# EAGLE design under_construction_v0 (EAGLE 6.6.0)
DATABASE: /Users/mhenstell/Documents/eagle/partsdb.txt
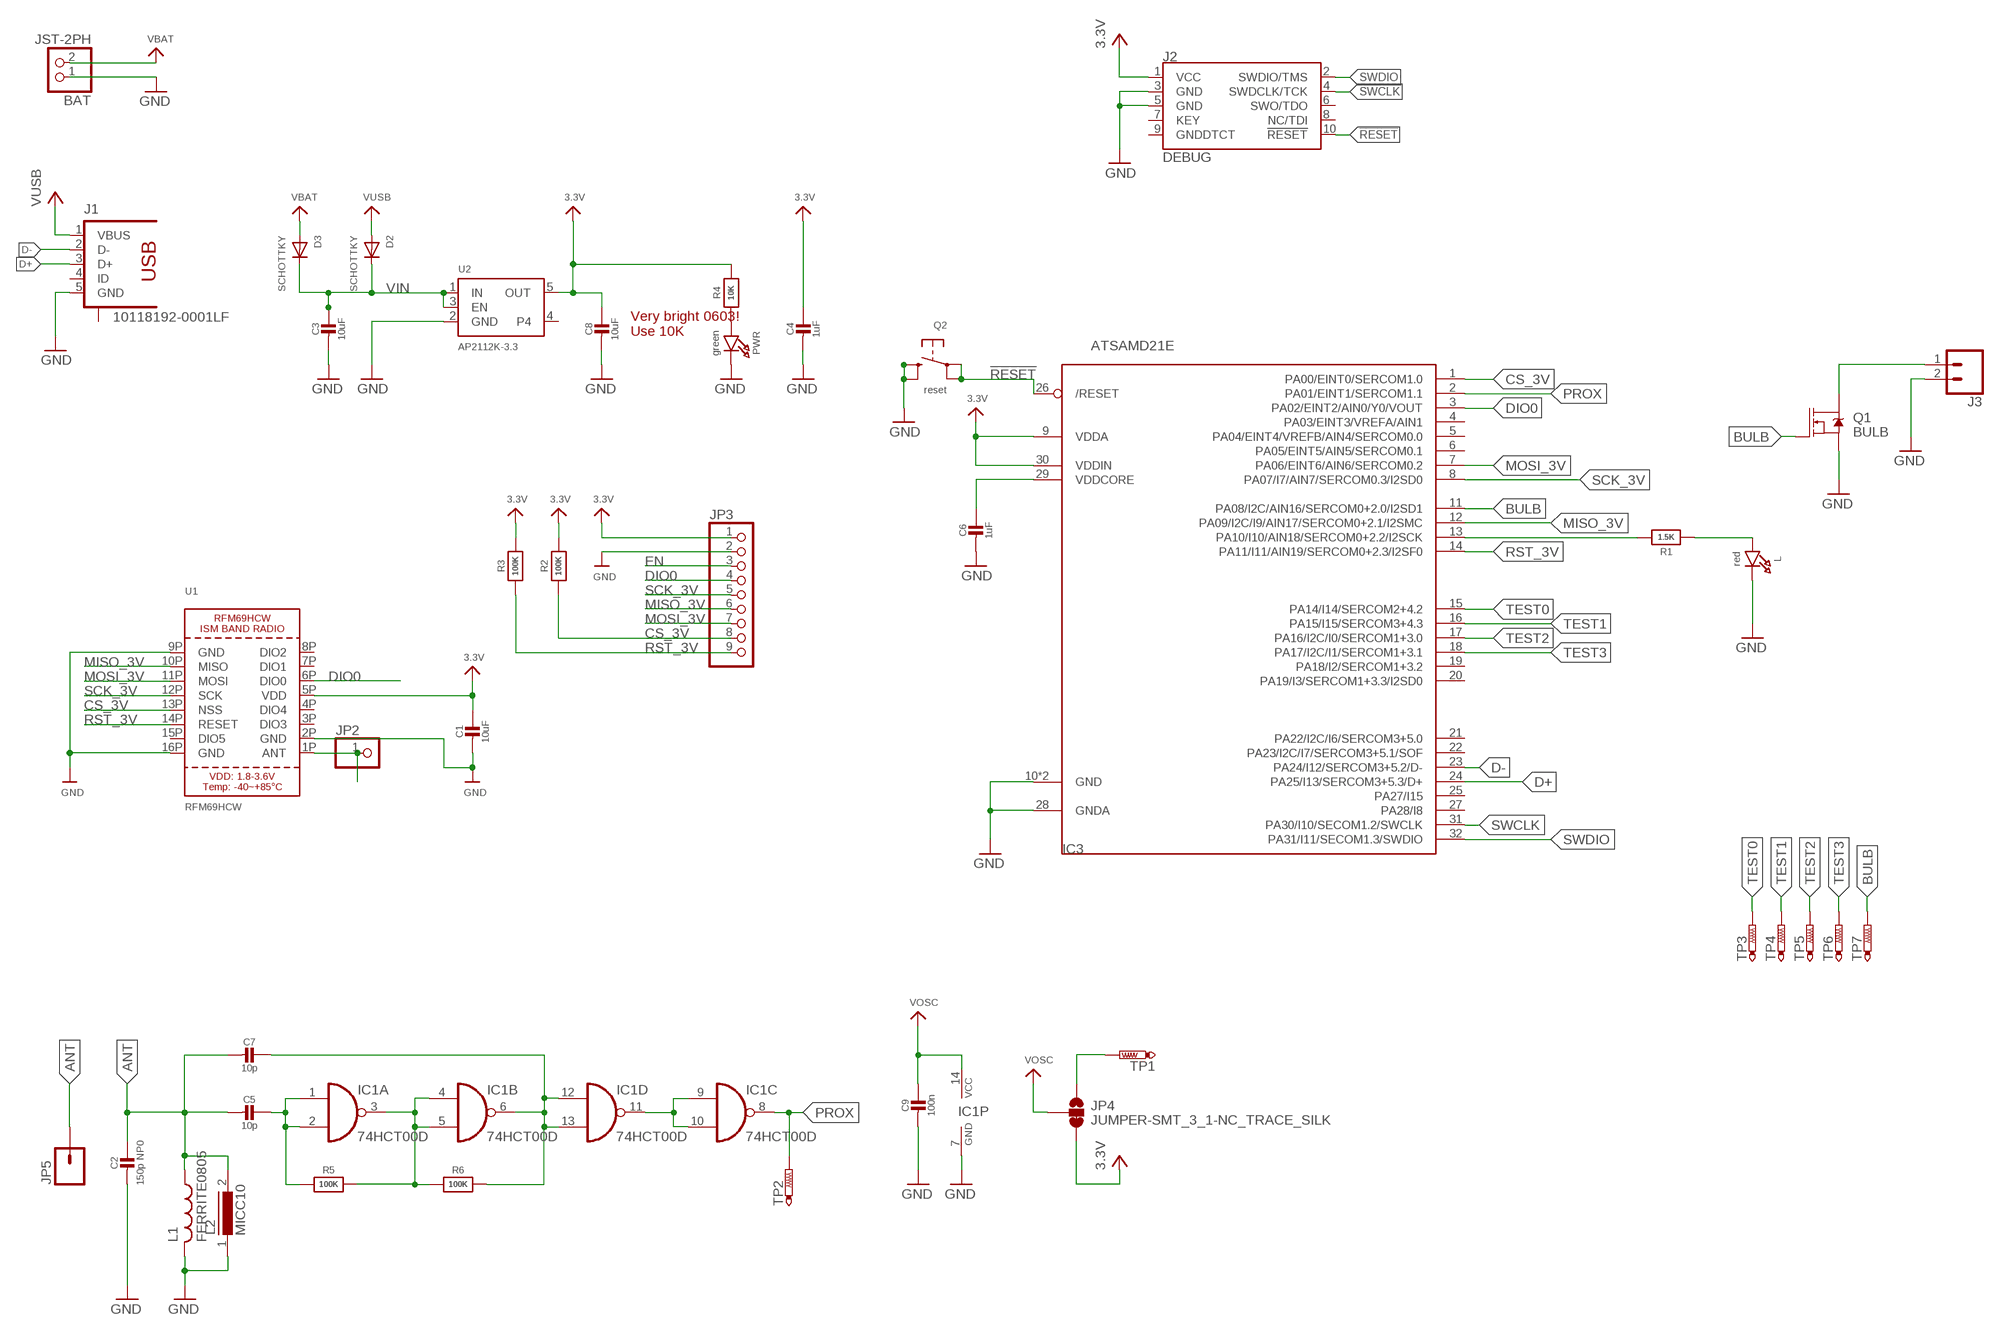
[diagram p0: schematic, sheet 1]

## Parts
BAT  JST-2PH  CON_JST_PH_2PIN  [JSTPH2]
C1  10uF  CAP_CERAMIC0805-NOOUTLINE  [0805-NO]
C2  150p NP0  CAP_CERAMIC0805-NOOUTLINE  [0805-NO]
C3  10uF  CAP_CERAMIC0805-NOOUTLINE  [0805-NO]
C4  1uF  CAP_CERAMIC0603_NO  [0603-NO]
C5  10p  CAP_CERAMIC0805-NOOUTLINE  [0805-NO]
C6  1uF  CAP_CERAMIC0603_NO  [0603-NO]
C7  10p  CAP_CERAMIC0805-NOOUTLINE  [0805-NO]
C8  10uF  CAP_CERAMIC0805-NOOUTLINE  [0805-NO]
C9  100n  CAP_CERAMIC0805-NOOUTLINE  [0805-NO]
D2  SCHOTTKY  DIODE_SOD-123FL  [SOD-123FL]
D3  SCHOTTKY  DIODE_SOD-123FL  [SOD-123FL]
IC1  74HCT00D  [SO14]
IC3  ATSAMD21E  [QFN32_5MM]
J1  10118192-0001LF  [10118192-0001LF]
J2  DEBUG  CORTEX_DEBUG_SMD  [SAMTECH_FTSH-105-01]
J3  CONN_02  [1X02]
JP2  HEADER-1X1ROUND  [1X01_ROUND]
JP3  HEADER-1X970MIL  [1X09_ROUND_70]
JP4  JUMPER-SMT_3_1-NC_TRACE_SILK  [SMT-JUMPER_3_1-NC_TRACE_SILK]
JP5  M01PTH  [1X01]
L  red  LED0603_NOOUTLINE  [CHIPLED_0603_NOOUTLINE]
L1  FERRITE0805  [0805]
L2  MICC10  [MICC10]
PWR  green  LED0603_NOOUTLINE  [CHIPLED_0603_NOOUTLINE]
Q1  BULB  MOSFET-NCH-2N7002PW  [SOT323]
Q2  reset  SWITCH_TACT_SMT4.6X2.8  [BTN_KMR2_4.6X2.8]
R1  1.5K  RESISTOR_0603_NOOUT  [0603-NO]
R2  100K  RESISTOR0805_NOOUTLINE  [0805-NO]
R3  100K  RESISTOR0805_NOOUTLINE  [0805-NO]
R4  10K  RESISTOR_0603_NOOUT  [0603-NO]
R5  100K  RESISTOR0805_NOOUTLINE  [0805-NO]
R6  100K  RESISTOR0805_NOOUTLINE  [0805-NO]
TP1  VOSC  PTR1TP15R  [TP15R]
TP2  PROX  PTR1TP15R  [TP15R]
TP3  PTR1TP10R  [TP10R]
TP4  PTR1TP10R  [TP10R]
TP5  PTR1TP10R  [TP10R]
TP6  PTR1TP10R  [TP10R]
TP7  PTR1TP10R  [TP10R]
U1  RFM69HCW  RFM69HCW_SMT  [RFMHCW_SMT]
U2  AP2112K-3.3  VREG_SOT23-5  [SOT23-5]

## Nets
3.3V: C1.1 C4.1 C8.1 IC3.9(VDDA) IC3.30(VDDIN) J2.1(VCC) JP3.1 JP4.3 R2.2 R3.2 R4.2 U1.5P(VDD) U2.5(OUT)
!RESET: IC3.26(/RESET) J2.10(!RESET) Q2.A'(P1) Q2.A(P)
ANT: C2.1 C5.2 C7.2 JP5.1 L1.1 L2.2
BULB: IC3.11(PA08/I2C/AIN16/SERCOM0+2.0/I2SD1) Q1.1(G) TP7.TP
CS_3V: IC3.1(PA00/EINT0/SERCOM1.0) JP3.8 R2.1 U1.13P(NSS)
D+: IC3.24(PA25/I13/SERCOM3+5.3/D+) J1.3(D+)
D-: IC3.23(PA24/I12/SERCOM3+5.2/D-) J1.2(D-)
DIO0: IC3.3(PA02/EINT2/AIN0/Y0/VOUT) JP3.4 U1.6P(DIO0)
EN: JP3.3
GND: BAT.1 C1.2 C2.2 C3.2 C4.2 C6.2 C8.2 C9.2 IC1.7(P:GND) IC3.10(GND) IC3.28(GNDA) IC3.33(GND) J1.5(GND) J2.3(GND) J2.5(GND) J3.2 JP3.2 L1.2 L2.1 L.C PWR.C Q1.2(S) Q2.B'(S1) Q2.B(S) U1.2P(GND) U1.9P(GND) U1.16P(GND) U2.2(GND)
MISO_3V: IC3.12(PA09/I2C/I9/AIN17/SERCOM0+2.1/I2SMC) JP3.6 U1.10P(MISO)
MOSI_3V: IC3.7(PA06/EINT6/AIN6/SERCOM0.2) JP3.7 U1.11P(MOSI)
N$1: JP2.1 U1.1P(ANT)
N$2: C5.1 IC1.1(A:I0) IC1.2(A:I1) R5.1
N$3: IC1.3(A:O) IC1.4(B:I0) IC1.5(B:I1) R5.2 R6.1
N$4: C7.1 IC1.6(B:O) IC1.12(D:I0) IC1.13(D:I1) R6.2
N$5: L.A R1.1
N$6: PWR.A R4.1
N$7: IC1.9(C:I0) IC1.10(C:I1) IC1.11(D:O)
N$8: IC3.13(PA10/I10/AIN18/SERCOM0+2.2/I2SCK) R1.2
N$9: J3.1 Q1.3(D)
N$10: JP4.1 TP1.TP
PROX: IC1.8(C:O) IC3.2(PA01/EINT1/SERCOM1.1) TP2.TP
RST_3V: IC3.14(PA11/I11/AIN19/SERCOM0+2.3/I2SF0) JP3.9 R3.1 U1.14P(RESET)
SCK_3V: IC3.8(PA07/I7/AIN7/SERCOM0.3/I2SD0) JP3.5 U1.12P(SCK)
SWCLK: IC3.31(PA30/I10/SECOM1.2/SWCLK) J2.4(SWDCLK/TCK)
SWDIO: IC3.32(PA31/I11/SECOM1.3/SWDIO) J2.2(SWDIO/TMS)
TEST0: IC3.15(PA14/I14/SERCOM2+4.2) TP3.TP
TEST1: IC3.16(PA15/I15/SERCOM3+4.3) TP4.TP
TEST2: IC3.17(PA16/I2C/I0/SERCOM1+3.0) TP5.TP
TEST3: IC3.18(PA17/I2C/I1/SERCOM1+3.1) TP6.TP
VBAT: BAT.2 D3.A
VDDCORE1: C6.1 IC3.29(VDDCORE)
VIN: C3.1 D2.C D3.C U2.1(IN) U2.3(EN)
VOSC: C9.1 IC1.14(P:VCC) JP4.2
VUSB: D2.A J1.1(VBUS)
Unconnected: IC3.4(PA03/EINT3/VREFA/AIN1) IC3.5(PA04/EINT4/VREFB/AIN4/SERCOM0.0) IC3.6(PA05/EINT5/AIN5/SERCOM0.1) IC3.19(PA18/I2/SERCOM1+3.2) IC3.20(PA19/I3/SERCOM1+3.3/I2SD0) IC3.21(PA22/I2C/I6/SERCOM3+5.0) IC3.22(PA23/I2C/I7/SERCOM3+5.1/SOF) IC3.25(PA27/I15) IC3.27(PA28/I8) J1.4(ID) J1.M1(S) J1.M2(S) J1.S1(S) J1.S2(S) J1.S3(S) J1.S4(S) J2.6(SWO/TDO) J2.7(KEY) J2.8(NC/TDI) J2.9(GNDDTCT) U1.3P(DIO3) U1.4P(DIO4) U1.7P(DIO1) U1.8P(DIO2) U1.15P(DIO5) U2.4

## Notes on the sheet
- Very bright 0603!
  Use 10K

## Library data of the parts
BAT = microbuilder:CON_JST_PH_2PIN: JST 2-Pin Right-Angle Connector PH-Series - 4UConnector: 17311 SH-Series - 4UConnector: 07278; PARTNO: S2B-PH-SM4-TB(LF)(SN)
C1 C3 C8 = microbuilder:CAP_CERAMIC: Ceramic Capacitors For new designs, use the packages preceded by an '_' character since they are more reliable: The following footprints should be used on most boards: _0402 - Standard footprint for regular board layouts _0603 - Standard footprint for regular board layouts _0805 - Standard footprint for regular board layouts _1206 - Standard footprint for regular board layouts For extremely tight-pitch boards where space is at a premium, the following 'micro-pitch' footprints can be used (smaller pads, no silkscreen outline, etc.): _0402MP - Micro-pitch footprint for very dense/compact boards _0603MP - Micro-pitch footprint for very dense/compact boards _0805MP - Micro-pitch footprint for very dense/compact boards _1206MP - Micro-pitch footprint for very dense/compact boards; PARTNO: GRM21BR71A106MA73L
C2 = microbuilder:CAP_CERAMIC: Ceramic Capacitors For new designs, use the packages preceded by an '_' character since they are more reliable: The following footprints should be used on most boards: _0402 - Standard footprint for regular board layouts _0603 - Standard footprint for regular board layouts _0805 - Standard footprint for regular board layouts _1206 - Standard footprint for regular board layouts For extremely tight-pitch boards where space is at a premium, the following 'micro-pitch' footprints can be used (smaller pads, no silkscreen outline, etc.): _0402MP - Micro-pitch footprint for very dense/compact boards _0603MP - Micro-pitch footprint for very dense/compact boards _0805MP - Micro-pitch footprint for very dense/compact boards _1206MP - Micro-pitch footprint for very dense/compact boards; PARTNO: C0805C151J5GACTU
C4 C6 = microbuilder:CAP_CERAMIC: Ceramic Capacitors For new designs, use the packages preceded by an '_' character since they are more reliable: The following footprints should be used on most boards: _0402 - Standard footprint for regular board layouts _0603 - Standard footprint for regular board layouts _0805 - Standard footprint for regular board layouts _1206 - Standard footprint for regular board layouts For extremely tight-pitch boards where space is at a premium, the following 'micro-pitch' footprints can be used (smaller pads, no silkscreen outline, etc.): _0402MP - Micro-pitch footprint for very dense/compact boards _0603MP - Micro-pitch footprint for very dense/compact boards _0805MP - Micro-pitch footprint for very dense/compact boards _1206MP - Micro-pitch footprint for very dense/compact boards; PARTNO: CL21B105KOFNNNE
C5 C7 = microbuilder:CAP_CERAMIC: Ceramic Capacitors For new designs, use the packages preceded by an '_' character since they are more reliable: The following footprints should be used on most boards: _0402 - Standard footprint for regular board layouts _0603 - Standard footprint for regular board layouts _0805 - Standard footprint for regular board layouts _1206 - Standard footprint for regular board layouts For extremely tight-pitch boards where space is at a premium, the following 'micro-pitch' footprints can be used (smaller pads, no silkscreen outline, etc.): _0402MP - Micro-pitch footprint for very dense/compact boards _0603MP - Micro-pitch footprint for very dense/compact boards _0805MP - Micro-pitch footprint for very dense/compact boards _1206MP - Micro-pitch footprint for very dense/compact boards; PARTNO: CL21C100JCANNNC
C9 = microbuilder:CAP_CERAMIC: Ceramic Capacitors For new designs, use the packages preceded by an '_' character since they are more reliable: The following footprints should be used on most boards: _0402 - Standard footprint for regular board layouts _0603 - Standard footprint for regular board layouts _0805 - Standard footprint for regular board layouts _1206 - Standard footprint for regular board layouts For extremely tight-pitch boards where space is at a premium, the following 'micro-pitch' footprints can be used (smaller pads, no silkscreen outline, etc.): _0402MP - Micro-pitch footprint for very dense/compact boards _0603MP - Micro-pitch footprint for very dense/compact boards _0805MP - Micro-pitch footprint for very dense/compact boards _1206MP - Micro-pitch footprint for very dense/compact boards; PARTNO: C0805C104K5RACTU
D2 D3 = adafruit:DIODE: Diode SMADIODE - SMA Surface Mount Package 20V 1A Schottky Diode Digikey: 641-1014-6-ND DO-1N4148 - Through Hole Small Current Diode SOD-123 20V 1 A (.5mV Vf) Schottky Diode - Digikey: MBRX120TPMSCT-ND SOD-323 10V 570mA (.38mV Vf, 3ns) Schottky Diode - Digikey: ZLLS410CT-ND SOD-523 30V 30mA Schottky Diode (RB751S-40TE61) - Digikey: RB751S-40TE61CT-ND SOT23-R/W - SOT23 Package (R = Solder Paste/Reflow Ovens, W = Hand-Soldering) BAT54Film 40V 300mA - Digikey: 497-7162-1-ND; PARTNO: B130LAW-7-F
IC1 = 74xx-eu:74*00: Quad 2-input NAND gate; PARTNO: SN74HC00NSR
IC3 = microbuilder:ATSAMD21E; PARTNO: ATSAMD21E18A-MU
J1 = 10118192-0001LF:10118192-0001LF: USB - microUSB Type B, FCI; AVAILABILITY: Good; DESCRIPTION: Conn Micro USB Type B RCP 5 POS 0.65mm Solder RA SMD 5 Terminal 1 Port T/R; MF: FCI; MP: 10118192-0001LF; PACKAGE: None; PARTNO: 10118192-0001LF; PRICE: 0.23 USD
J2 = SparkFun-Connectors:CORTEX_DEBUG: Cortex Debug Connector - 10 pin Supports JTAG debug, Serial Wire debug, and Serial Wire Viewer. PTH and SMD connector options available. General Connector Information <http://infocenter.arm.com/help/topic/com.arm.doc.faqs/attached/13634/cortex_debug_connectors.pdf> Products: PTH Connector <http://www.digikey.com/product-detail/en/cnc-tech/3220-10-0100-00/1175-1627-ND/3883661> -via Digi-Key SparkFun PSoc <https://www.sparkfun.com/products/13229> SparkFun T <https://www.sparkfun.com/products/13810>; PARTNO: 3220-10-0300-00
J3 = SparkFun-Connectors:CONN_02: Multi connection point. Often used as Generic Header-pin footprint for 0.1 inch spaced/style header connections On any of the 0.1 inch spaced packages, you can populate with these: Break Away Headers - Straight <https://www.sparkfun.com/products/116> (PRT-00116) Break Away Male Headers - Right Angle <https://www.sparkfun.com/products/553> (PRT-00553) Female Headers <https://www.sparkfun.com/products/115> (PRT-00115) Break Away Headers - Machine Pin <https://www.sparkfun.com/products/117> (PRT-00117) Break Away Female Headers - Swiss Machine Pin <https://www.sparkfun.com/products/743> (PRT-00743) For SCREWTERMINALS and SPRING TERMINALS visit here: Screw Terimnals on SparkFun.com <https://www.sparkfun.com/search/results?term=Screw+Terminals> (5mm/3.5mm/2.54mm spacing) This device is also useful as a general connection point to wire up your design to another part of your project. Our various solder wires solder well into these plated through hole pads. Hook-Up Wire - Assortment (Stranded, 22 AWG) <https://www.sparkfun.com/products/11375> (PRT-11375) Hook-Up Wire - Assortment (Solid Core, 22 AWG) <https://www.sparkfun.com/products/11367> (PRT-11367) View the entire wire category on our website here <https://www.sparkfun.com/categories/141> Special notes: Molex polarized connector foot print use with: PRT-08233 with associated crimp pins and housings. 2.54_SCREWTERM for use with PRT-10571. 3.5mm Screw Terminal footprints for PRT-08084 5mm Screw Terminal footprints for use with PRT-08432
JP2 = microbuilder:HEADER-1X1: PIN HEADER
JP3 = microbuilder:HEADER-1X9: PIN HEADER
JP4 = SparkFun-Jumpers:JUMPER-SMT_3_1-NC_TRACE: Normally closed trace jumper (1 of 2 connections) This jumper has a trace between two pads so it's normally closed (NC). The other connection is normally open (NO). Use a razor knife to open the connection. For best results follow the IPC guidelines for cutting traces: Cutout at least 0.063 mm (0.005 in). Remove all loose material to clean up the cut area. Seal the cut with an approved epoxy. Reapply solder to reclose the connection, or to close the NO connection.
JP5 = RFM69HCW_BOB:M01: Header 1 Standard 1-pin 0.1" header. Use with straight break away headers (SKU : PRT-00116), right angle break away headers (PRT-00553), swiss pins (PRT-00743), machine pins (PRT-00117), and female headers (PRT-00115).
L PWR = microbuilder:LED: LED 0603 - 0603 Surface Mount Package 2mA: Green LED - Low Power (3.9mcd, 2ma, 1.7Vf) - Digikey: 475-2709-2-ND Orange LED - Low Power (9.8mcd, 2ma, 1.8Vf) - Digikey: 475-1194-2-ND Red LED - Low Power (5mcd, 2ma, 1.8Vf) - Digikey: 475-1195-2-ND Yellow LED - Low Power (7mcd, 2ma, 1.8Vf) - Digikey: 475-1196-2-ND 5mA: Blue LED - Low Power (17mcd, 5ma, 2.9Vf) - Digikey: LNJ937W8CRACT-ND 0805 - 0805 Surface Mount Package 2mA: Red LED (8.8mcd, 2mA, 1.8Vf, Clear) - Low Power [Digikey: 475-2510-1-ND] Green LED (5mcd, 2mA, 1.8Vf, Clear) - Low Power [Digikey: 475-2730-1-ND] Yellow LED (11.3mcd, 2mA, 1.8Vf, Clear) - Low Power [Digikey: 475-2555-1-ND] 20mA: Red LED (104mcd, 20mA, Diffused) - LS R976 [Digikey: 475-1278-6-ND] Red LED (12mcd, 20mA, 2.0Vf, Clear) - APT2012EC [Digikey: 754-1128-1-ND] Green LED (15mcd, 20mA, 2.2Vf, Clear) - APT2012GC [Digikey: 754-1131-1-ND] Orange LED (160mcd, 20mA, 2.1Vf, Clear) - APT2012SECK [Digikey: 754-1130-1-ND] 1206 - 1206 Surface Mount Package Green LED (26mcd, 20mA, Diffused) - LG N971 [Digikey: 475-1407-6-ND] Red LED (15mcd, 20mA, Diffused) - LH N974 [Digikey: 475-1416-6-ND] Cree - Cree High-Power Surface Mount LEDs XPEBWT-L1-0000-00D50 - White 111lm 350mA 2.9Vf 6200K 110° XTEAWT-00-0000-00000LEE3 - White 114lm 350mA 2.85Vf 5000K 115° Everlight - Everlight 45-21 Series Surface Mount LEDs 45-21/QK2C-B2832AC2CB2/2T - Warm White 2000mcd 20mA 3.25Vf 3050K 120° 45-21/LK2C-B38452C4CB2/2T - Nuetral White 2000mcd 20mA 3.25Vf 4150K 120° 45-21/LK2C-B50634C6CB2/2T - Cold White 2200mcd 20mA 3.25Vf 5650K 120° PLCC2 Reverse Mount LS T77K-J1L2-1-0-2-R18-Z - Red 11.25mcd 2mA 1.8Vf 630nm 120° LO T77K-L1M2-24-Z - Orange 19.6mcd 2mA 1.8Vf 606nm 120° LY T77K-K2M1-26-Z - Yellow 15.7mcd 2mA 1.8Vf 587nm 120°
L1 = Livestream:FERRITE; PARTNO: MLZ2012N100LT000
L2 = inductors:MICC10: INDUCTOR; PARTNO: B78108T1103K000
Q1 = SparkFun-DiscreteSemi:MOSFET-NCH: N-channel MOSFETs Voltage controlled devices that allow control of high current outputs. SparkFun Products: SparkFun OpenScale <https://www.sparkfun.com/products/13261> SparkFun Digital Sandbox <https://www.sparkfun.com/products/12651> SparkFun Monster Moto Shield <https://www.sparkfun.com/products/10182> SparkFun MOSFET Power Controller <https://www.sparkfun.com/products/11214>; PARTNO: DMG1012UW-7; PROD_ID: TRANS-11151; VALUE: 310mA/60V/1.6Ω
Q2 = microbuilder:SWITCH_TACT_SMT: SMT Tact Switches 6x6mm - Digikey: P12940SCT-ND KMR2 (4.6x2.8mm) - Digikey: 401-1426-1-ND EVQ-PQHB55 - Light Touch, 160GF (4.5x4.5mm) - Digikey: P8090SCT-ND KMT0 - KMT021 NGJ LHS (etc.) IP68/Waterproof - Digikey: CKN10289CT-ND; PARTNO: KMR442G ULC LFS
R1 = microbuilder:RESISTOR: Resistors For new designs, use the packages preceded by an '_' character since they are more reliable: The following footprints should be used on most boards: _0402 - Standard footprint for regular board layouts _0603 - Standard footprint for regular board layouts _0805 - Standard footprint for regular board layouts _1206 - Standard footprint for regular board layouts For extremely tight-pitch boards where space is at a premium, the following 'micro-pitch' footprints can be used (smaller pads, no silkscreen outline, etc.): _0402MP - Micro-pitch footprint for very dense/compact boards _0603MP - Micro-pitch footprint for very dense/compact boards _0805MP - Micro-pitch footprint for very dense/compact boards _1206MP - Micro-pitch footprint for very dense/compact boards; PARTNO: RNCP0603FTD1K50
R2 R3 R5 R6 = microbuilder:RESISTOR: Resistors For new designs, use the packages preceded by an '_' character since they are more reliable: The following footprints should be used on most boards: _0402 - Standard footprint for regular board layouts _0603 - Standard footprint for regular board layouts _0805 - Standard footprint for regular board layouts _1206 - Standard footprint for regular board layouts For extremely tight-pitch boards where space is at a premium, the following 'micro-pitch' footprints can be used (smaller pads, no silkscreen outline, etc.): _0402MP - Micro-pitch footprint for very dense/compact boards _0603MP - Micro-pitch footprint for very dense/compact boards _0805MP - Micro-pitch footprint for very dense/compact boards _1206MP - Micro-pitch footprint for very dense/compact boards; PARTNO: RC2012J104CS
R4 = microbuilder:RESISTOR: Resistors For new designs, use the packages preceded by an '_' character since they are more reliable: The following footprints should be used on most boards: _0402 - Standard footprint for regular board layouts _0603 - Standard footprint for regular board layouts _0805 - Standard footprint for regular board layouts _1206 - Standard footprint for regular board layouts For extremely tight-pitch boards where space is at a premium, the following 'micro-pitch' footprints can be used (smaller pads, no silkscreen outline, etc.): _0402MP - Micro-pitch footprint for very dense/compact boards _0603MP - Micro-pitch footprint for very dense/compact boards _0805MP - Micro-pitch footprint for very dense/compact boards _1206MP - Micro-pitch footprint for very dense/compact boards
TP1-TP7 = tenna_avr_AD7021_v0_9_shrink:PTR1: TEST PIN .063mm, 25mil circular test point
U1 = microbuilder:RFM69HCW: RFM69HCW - ISM Band RF Transceiver
U2 = microbuilder:VREG_SOT23-5: SOT23-5 Fixed Voltage Regulators Part Current Out V Out V In V Dropout θJA (°C/W) TJ (°C) Digikey Part No. ADP121 150mA 3.3V 3.4-5.5V 0.09V @ 150mA -- -- ADP121-AUJZ33R7CT-ND ADP121 150mA 3.0V 3.1-5.5V 0.09V @ 150mA -- -- ADP121-AUJZ30R7CT-ND ADP122 300mA 3.3V 3.4-5.5V 0.085V @ 300mA -- -- ADP122AUJZ-3.3-R7CT-ND ADP1712 300mA 3.3V 3.5-5.5V 0.17V @ 300mA -- -- ADP1712AUJZ-3.3-R7TR-ND AP7311 (Low Cost) 150mA 3.3V 3.5-6V 0.15V @ 150mA -- -- AP7311-33WG-7DICT-ND LD39015M18R 150mA 1.8V 1.9V-5.5V 0.08V @ 100mA -- -- 497-6977-1-ND LP2985A-33DBVR 150mA 3.3V 3.3-16V 0.28V @ 150mA 206 150 296-18479-1-ND MCP1824T-3302E/OT 300mA 3.3V 3.5V-6V 0.2V @ 300mA -- -- MCP1824T-3302E/OTCT-ND MIC5205-2.5YM5 TR 150mA 2.5V 2.7-16V 0.165V @ 150mA -- -- 576-1257-2-ND MIC5205-3.0YM5 TR 150mA 3.0V 3.2V-16V 0.165V @ 150mA -- -- 576-1258-2-ND MIC5205-3.3YM5 TR 150mA 3.3V 3.5V-16V 0.165V @ 150mA -- -- 576-1259-2-ND TPS780330220 150mA 3.3V+2.2V 3.6-5.5V 250mV Max -- -- 296-23332-1-ND TDA3663/N1,135 100mA 3.3V 3.5-45V 0.18V @ 50mA -- -- 568-5343-1-ND Max operating temp can be calculated using θJA, TJ (max junction temperature), and power in watts. Set the "Maximum Ambient Temperature" until it reaches TJ ("Max Junction Temperature"), which is the absolute limit for safe use of the regulator: Heat Sink Temperature Calculator <http://www.daycounter.com/Calculators/Heat-Sink-Temperature-Calculator.phtml> For example, With 12V source into a 3.3V LP2985 and a 30mA load, we are dissipating (12V-3.3V) * 0.03A = 0.261W. With a θJA of 206 °C/W, a TJ of 150°C, and 261mW we can safely use the chip without a heat sink up to 75°C (=147.1°C Junction Temperature).; PARTNO: AP2112K-3.3TRG1

## Board
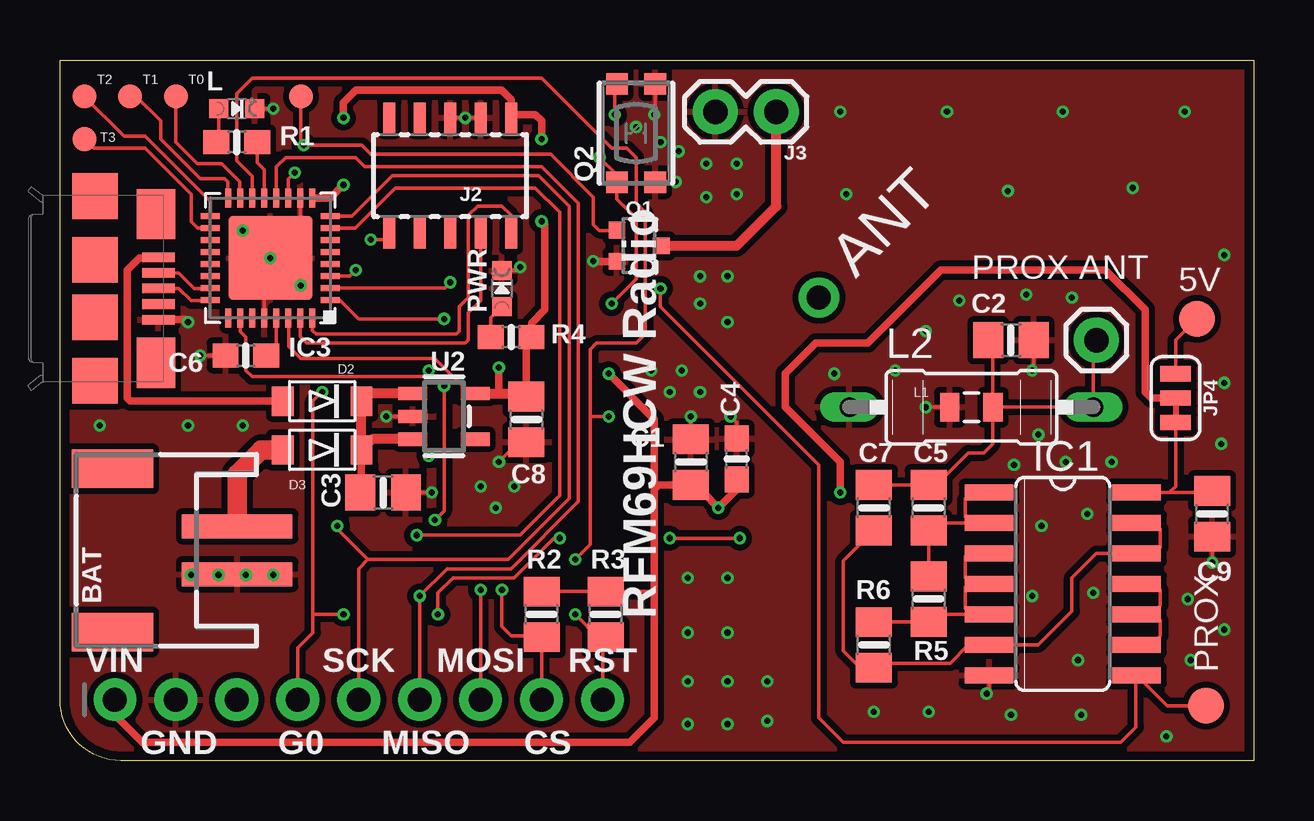
[diagram p1: board, top side]
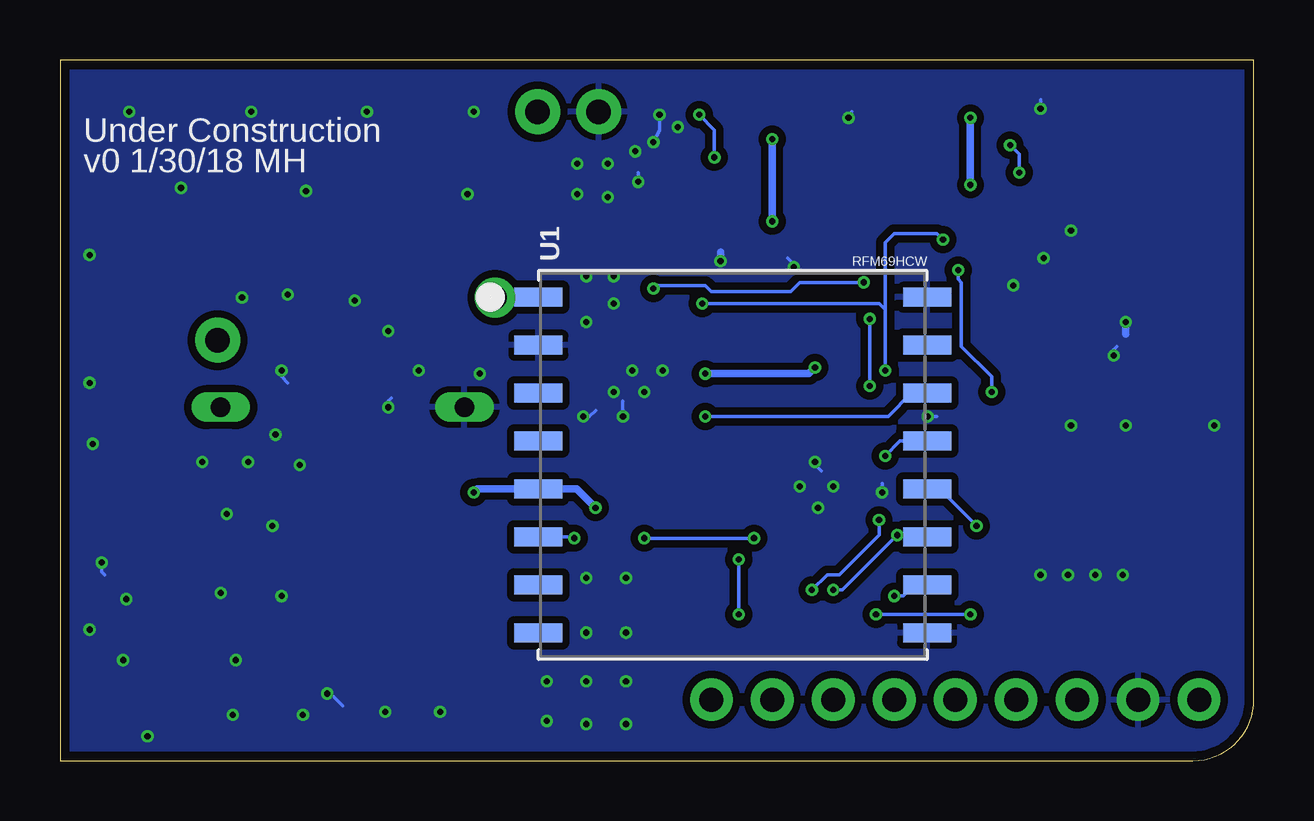
[diagram p2: board, bottom side, seen from below]

Size 49.75 x 29.21 mm. Coordinates in mm from the lower left corner, seen from the top.
Outline: 49.75,29.21 49.75,0 2.54,0 arc-90 0,2.54 0,29.21 49.75,29.21
Copper layers (1*16): Top 0.035559375mm / dielectric 1.6mm / Bottom 0.035559375mm
Design rules "oshpark-2layer *": minimum track width 6mil, minimum drill 10mil, track to track 6mil, track to pad 6mil, pad to pad 6mil, via to via 6mil, smd to smd 0mil, copper to edge 15mil, drill to drill 6mil, minimum pad ring 5mil, minimum via ring 5mil, stop-mask expansion 2.5mil, vias tented up to drill 0mil, thermal gap 10mil

### Footprints (pad centres in the part's own frame; a part is rotated, then mirrored left to right if it is on the bottom)
JSTPH2 = smd 1 x 4.6: 1 -1,-3.7; 2 1,-3.7 | smd 1.6 x 3.4: NC1 -3.4,1.5; NC2 3.4,1.5
0805-NO = smd 1.24 x 1.5: 1 -0.95,0; 2 0.95,0
0603-NO = smd 1.075 x 1: 1 -0.85,0; 2 0.85,0
SOD-123FL = smd 0.91 x 1.22: A 1.637,0; C -1.637,0
SO14 = smd 0.66 x 2.032: 1 -3.81,-3.073; 2 -2.54,-3.073; 3 -1.27,-3.073; 4 0,-3.073; 5 1.27,-3.073; 6 2.54,-3.073; 7 3.81,-3.073; 8 3.81,3.073; 9 2.54,3.073; 10 1.27,3.073; 11 0,3.073; 12 -1.27,3.073; 13 -2.54,3.073; 14 -3.81,3.073
QFN32_5MM = smd 0.8 x 0.25: 1 -2.5,1.75; 2 -2.5,1.25; 3 -2.5,0.75; 4 -2.5,0.25; 5 -2.5,-0.25; 6 -2.5,-0.75; 7 -2.5,-1.25; 8 -2.5,-1.75; 17 2.5,-1.75; 18 2.5,-1.25; 19 2.5,-0.75; 20 2.5,-0.25; 21 2.5,0.25; 22 2.5,0.75; 23 2.5,1.25; 24 2.5,1.75 | smd 0.25 x 0.8: 9 -1.75,-2.5; 10 -1.25,-2.5; 11 -0.75,-2.5; 12 -0.25,-2.5; 13 0.25,-2.5; 14 0.75,-2.5; 15 1.25,-2.5; 16 1.75,-2.5; 25 1.75,2.5; 26 1.25,2.5; 27 0.75,2.5; 28 0.25,2.5; 29 -0.25,2.5; 30 -0.75,2.5; 31 -1.25,2.5; 32 -1.75,2.5 | smd 3.5 x 3.5: 33 0,0
10118192-0001LF = smd 0.4 x 1.35: 1 -1.3,4.1; 2 -0.65,4.1; 3 0,4.1; 4 0.65,4.1; 5 1.3,4.1 | smd 1.9 x 1.9: M1 -1.2,1.45; M2 1.2,1.45; S1 -3.85,1.45; S2 3.85,1.45 | smd 2.1 x 1.6: S3 -3.1,4; S4 3.1,4
SAMTECH_FTSH-105-01 = smd 0.508 x 1.27: 1 -2.54,-2.413; 2 -2.54,2.413; 3 -1.27,-2.413; 4 -1.27,2.413; 5 0,-2.413; 6 0,2.413; 7 1.27,-2.413; 8 1.27,2.413; 9 2.54,-2.413; 10 2.54,2.413
1X02 = drill 1.016 pad 1.88: 1 0,0; 2 2.54,0
1X01_ROUND = drill 1 pad 1.676: 1 0,0
1X09_ROUND_70 = drill 1 pad 1.778: 1 -10.16,0; 2 -7.62,0; 3 -5.08,0; 4 -2.54,0; 5 0,0; 6 2.54,0; 7 5.08,0; 8 7.62,0; 9 10.16,0
SMT-JUMPER_3_1-NC_TRACE_SILK = smd 0.635 x 1.27: 1 -1.016,0; 2 0,0; 3 1.016,0
1X01 = drill 1.016 pad 1.88: 1 0,0
CHIPLED_0603_NOOUTLINE = smd 0.8 x 0.8: A 0,-0.75; C 0,0.75
0805 = smd 0.8 x 1.2: 1 -0.9,0; 2 0.9,0
MICC10 = drill 0.813 long: 1 -5.08,0; 2 5.08,0
SOT323 = smd 0.7 x 0.7: 1 -0.65,-0.925; 2 0.65,-0.925; 3 0,0.925
BTN_KMR2_4.6X2.8 = smd 0.9 x 0.9: A 2.05,0.8; A' -2.05,0.8; B 2.05,-0.8; B' -2.05,-0.8
TP15R = smd 1.5 x 1.5: TP 0,0
TP10R = smd 1 x 1: TP 0,0
RFMHCW_SMT = smd 2 x 0.8: 1P 8.1,-7; 2P 8.1,-5; 3P 8.1,-3; 4P 8.1,-1; 5P 8.1,1; 6P 8.1,3; 7P 8.1,5; 8P 8.1,7; 9P -8.1,7; 10P -8.1,5; 11P -8.1,3; 12P -8.1,1; 13P -8.1,-1; 14P -8.1,-3; 15P -8.1,-5; 16P -8.1,-7
SOT23-5 = smd 0.55 x 1.2: 1 -0.95,-1.3; 2 0,-1.3; 3 0.95,-1.3; 4 0.95,1.3; 5 -0.95,1.3

### Placement (x,y rotation side)
BAT  3.68,8.76 90 top
C1  26.29,12.45 90 top
C2  39.62,17.53 0 top
C3  13.46,11.18 0 top
C4  28.19,12.57 90 top
C5  36.2,10.54 90 top
C6  7.75,16.89 180 top
C7  33.91,10.54 90 top
C8  19.43,14.22 270 top
C9  48.01,10.29 270 top
D2  10.92,14.99 180 top
D3  10.92,12.95 180 top
IC1  41.78,7.37 270 top
IC3  8.76,20.95 180 top
J1  0,19.68 270 top
J2  16.26,24.38 180 top
J3  29.84,27.05 180 top
JP2  31.62,19.3 0 top
JP3  12.45,2.54 0 top
JP4  46.48,15.11 270 top
JP5  43.18,17.53 0 top
L  7.37,27.18 270 top
L1  37.97,14.73 180 top
L2  37.97,14.73 0 top
PWR  18.41,19.68 0 top
Q1  24.13,21.46 270 top
Q2  24,26.16 90 top
R1  7.37,25.78 0 top
R2  20.07,6.1 90 top
R3  22.73,6.1 90 top
R4  18.8,17.65 0 top
R5  36.2,6.73 270 top
R6  33.91,4.83 270 top
TP1  47.37,18.41 0 top
TP2  47.75,2.29 0 top
TP3  4.83,27.69 0 top
TP4  2.92,27.69 0 top
TP5  1.02,27.69 0 top
TP6  1.02,25.91 0 top
TP7  10.03,27.69 0 top
U1  21.72,12.32 180 bottom
U2  16,14.35 270 top

### Tracks (layer width: path | path; a pad name or v marks a point on that pad's centre or on a via)
3.3V  (via drill 0.25)
  Top 0.152: IC3.30 9.53,17.27 10.03,16.76 15.62,16.76 17.08,15.3 U2.5 | R2.2 R3.2 24.7,7.05 24.76,7.11
  Top 0.305: v11.81,24 11.26,23.45 IC3.9 | JP3.1 2.29,1.91 3.43,0.76 23.75,0.76 24.76,1.78 24.76,7.11 24.76,11.3 | 24.76,11.3 24.76,14.22 v22.86,16.13 | v18.29,16.38 18.29,15.43 18.41,15.3 | 24.76,11.3 24.96,11.5 C1.1 26.61,11.18 26.8,11.18 v27.43,10.54 28.19,11.3 C4.1 | v11.81,26.8 11.81,27.43 12.32,27.94 18.41,27.94 18.8,27.56 J2.1 18.92,26.92 19.81,26.92 20.07,26.67 v20.07,25.91 | R4.2 19.65,18.25 20.19,18.8 20.19,22.35 v20.07,22.48 | 19.43,17.44 C8.1 | v32.51,11.18 32.51,12.45 30.23,14.73 30.23,16.13 31.5,17.4 33.66,17.4 36.7,20.45 43.56,20.45 45.21,18.8 45.21,15.37 45.47,15.11 46.48,15.11
  Top 0.406: U2.5 18.41,15.3 19.3,15.3 C8.1 | 19.43,17.44 R4.2
  Bottom 0.305: v22.86,16.13 18.54,16.13 v18.29,16.38 | v27.43,10.54 28.21,11.32 U1.5P 32.37,11.32 v32.51,11.18 | v11.81,24 v11.81,26.8 | v20.07,22.48 v20.07,25.91
!RESET  (via drill 0.25)
  Top 0.152: IC3.26 7.51,17.89 7.75,17.65 7.75,16.26 8,16 15.11,16 v15.37,16.26 | v12.95,21.72 13.46,21.72 J2.10 | v22.99,19.05 24,20.07 24,22.61 23.2,23.41 Q2.A' 23.2,24.42 v22.48,25.15 | v23.11,26.92 23.11,28.12 Q2.A
  Bottom 0.152: v15.37,16.26 15.37,18.8 | 15.37,18.8 15.37,21.59 14.99,21.97 13.21,21.97 v12.95,21.72 | v22.99,19.05 15.62,19.05 15.37,18.8 | v22.48,25.15 22.48,26.29 v23.11,26.92
ANT
  Top 0.152: C7.2 C5.2 36.51,11.49 37.85,12.83 38.48,12.83 38.86,13.21 38.86,14.72 L1.1 | L1.1 L2.2 43.05,17.4 JP5.1 | L1.1 38.87,17.33 C2.1
BULB  (via drill 0.25)
  Top 0.152: IC3.11 9.51,24.25 v9.78,24.51 | Q1.1 23.06,22.1 22.48,22.1 22.22,22.35 22.22,23.5 20.45,25.27 12.95,25.27 12.57,25.65 v10.16,25.65 10.03,25.78 TP7.TP
  Bottom 0.152: v9.78,24.51 9.78,25.27 v10.16,25.65
CS_3V  (via drill 0.25)
  Top 0.152: IC3.1 11.66,19.2 12.45,18.41 v16,18.41 | v16,15.62 16,12.7 | 16,12.7 16,10.41 v15.62,10.03 | v18.41,7.11 18.41,5.59 18.8,5.21 20,5.21 R2.1 JP3.8 | v15.37,12.7 16,12.7
  Bottom 0.152: v15.62,10.03 15.62,9.4 17.27,7.75 17.78,7.75 v18.41,7.11 | v16,18.41 v16,15.62 | U1.13P 14.75,13.32 v15.37,12.7
D+
  Top 0.152: J1.3 4.95,19.68 5.46,19.18 6.23,19.18 IC3.24
D-
  Top 0.152: J1.2 4.94,20.34 5.59,19.68 6.24,19.68 IC3.23
DIO0  (via drill 0.25)
  Top 0.152: IC3.3 12.08,20.2 v12.32,20.45 | JP3.4 9.91,4.7 10.54,5.33 10.54,6.1 | 10.54,6.1 10.54,14.99 v10.92,15.37 | v28.32,9.27 v25.4,9.27 | v20.83,9.27 20.57,9.27 18.92,7.62 16.38,7.62 15.75,6.99 v15.75,6.1 | v11.81,6.1 10.54,6.1
  Bottom 0.152: v12.32,20.45 12.32,20.07 12.19,19.94 12.19,17.27 10.92,16 v10.92,15.37 | U1.6P 28.37,9.32 v28.32,9.27 | v25.4,9.27 v20.83,9.27 | v15.75,6.1 v11.81,6.1
GND  (via drill 0.25)
  Top 0.152: IC3.10 10.01,22.33 9.91,22.23 9.91,22.1 IC3.33 8.51,20.7 IC3.28 | C6.2 v5.84,16.89 | C3.2 v15.49,11.18 | U2.2 v13.59,14.35 | C8.2 19.12,13.27 v18.29,12.45 | C4.2 28.19,14.1 v27.94,14.35 | C1.2 v26.29,14.35 | PWR.C 19.04,20.43 v19.18,20.57 | J2.5 v16.89,26.8 J2.3 | Q2.B' 25.64,24.11 v25.65,24.13 | Q2.B 24.8,27.22 v24.76,26.92 | L.C v8.89,27.18 | IC1.7 38.71,2.9 v38.61,2.79 | C9.2 v48.01,8.26 | L1.2 v36.07,14.73 | C2.2 40.57,16.32 v40.51,16.26 | v6.6,7.75 7.24,7.75 BAT.1
  Top 0.305: J1.5 5.24,18.39 v5.33,18.29 | Q1.2 22.24,20.81 v22.22,20.83
  Bottom 0.152: v5.84,16.89 5.84,17.14 5.71,17.27 | v15.49,11.18 15.49,11.56 | v13.59,14.35 13.21,14.35 | v18.29,12.45 18.29,12.32 18.03,12.06 | v27.94,14.35 27.69,14.35 27.43,14.61 | v26.29,14.35 26.29,14.99 | v19.18,20.57 19.18,20.7 19.43,20.95 | v16.89,26.8 16.89,26.92 16.76,27.05 | v25.65,24.13 25.65,24.51 | v24.76,26.92 24.76,26.29 v25.02,25.78 | v8.89,27.18 8.89,27.56 | v38.61,2.79 38.48,2.79 37.97,2.29 | v48.01,8.26 48.01,7.87 47.88,7.75 | v36.07,14.73 36.07,14.99 35.94,15.11 | v40.51,16.26 40.51,16 40.26,15.75
  Bottom 0.305: v5.33,18.29 5.33,17.78 | v22.22,20.83 22.22,21.21
  other vias: 8.76,20.95 7.62,22.1 10.03,19.81 5.46,7.75 8.89,7.75 7.75,7.75 24,26.42 25.78,25.4 26.92,24.89 28.19,24.89 26.92,23.5 28.19,23.62 26.67,20.19 27.81,20.19 26.67,19.05 27.81,18.29 24.64,16.26 25.91,16.26 25.4,15.37 26.67,15.37 26.16,7.62 27.81,7.62 26.16,5.33 27.81,5.33 26.16,3.3 27.81,3.3 29.46,3.3 26.16,1.52 27.81,1.52 29.46,1.65 17.53,11.43 18.92,11.43 18.16,10.54 1.65,13.97 5.33,13.97 7.62,13.97 32.51,27.05 36.96,27.05 41.78,27.05 46.86,27.05 32.77,23.62 39.5,23.75 44.7,23.88 32.26,16.13 34.8,16.26 36.07,17.91 37.47,19.18 40.26,19.43 42.16,19.3 39.75,12.32 41.91,12.45 43.82,12.45 40.77,13.59 33.91,2.03 36.2,2.03 39.62,1.91 42.55,1.91 46.1,1.02 47.12,4.19 48.51,5.46 46.99,6.73 42.42,4.19 43.05,6.99 40.51,6.86 40.89,9.78 42.8,10.29 48.39,13.21 48.51,15.75 48.51,21.08
  pour Bottom (isolate 0.305): 49.75,29.08 49.75,-0.13 0,0 0,29.21
  pour Top (isolate 0.254): 49.75,29.08 49.75,-0.13 0,0 0,29.21
MISO_3V  (via drill 0.25)
  Top 0.152: JP3.6 v14.99,6.86 16.13,8 18.8,8 21.59,10.79 21.59,23.24 20.07,24.77 12.7,24.77 12.32,25.15 9.4,25.15 9.02,24.77 IC3.12
  Bottom 0.152: v14.99,6.86 14.61,6.86 14.22,7.24 13.7,7.24 U1.10P
MOSI_3V  (via drill 0.25)
  Top 0.152: IC3.7 12.3,22.2 13.97,23.88 19.81,23.88 20.83,22.86 20.83,11.05 19.18,9.4 v14.86,9.4 | JP3.7 v17.53,7.11
  Bottom 0.152: U1.11P 13.7,9.4 v14.86,9.4 17.14,7.11 v17.53,7.11
N$1
  Bottom 0.406: U1.1P 31.61,19.32 JP2.1
N$2
  Top 0.152: R5.1 C5.1 36.51,9.91 IC1.2 37.97,9.91 37.72,10.16 37.72,10.92 37.85,11.05 38.58,11.05 IC1.1
N$3
  Top 0.152: R6.1 R5.2 36.51,6.1 IC1.5 37.97,6.1 37.72,6.35 37.72,7.24 37.85,7.37 IC1.4 37.97,7.37 37.72,7.62 37.72,8.51 37.85,8.64 IC1.3
N$4
  Top 0.152: 34.1,4.06 37.08,4.06 37.85,4.83 IC1.6 40.77,4.83 42.16,6.22 42.16,7.62 43.18,8.64 IC1.12 44.98,8.76 45.72,8.76 45.85,8.89 45.85,9.65 45.72,9.65 45.47,9.91 IC1.13 | 34.1,4.06 R6.2 | 34.1,4.06 33.15,4.06 32.64,4.57 32.64,8.32 C7.1
N$5
  Top 0.152: L.A 6.62,25.88 R1.1
N$6
  Top 0.152: R4.1 17.95,18.47 PWR.A
N$7
  Top 0.152: IC1.11 45.59,7.37 45.85,7.11 45.85,6.48 45.72,6.35 45.11,6.35 IC1.10 45.59,6.1 45.85,5.84 45.85,5.21 45.72,5.08 45.11,5.08 IC1.9
N$8
  Top 0.152: R1.2 8.22,24.93 8.51,24.64 IC3.13
N$9
  Top 0.406: Q1.3 28.19,21.46 29.84,23.11 J3.1
N$10
  Top 0.152: JP4.1 46.48,17.53 TP1.TP
PROX  (via drill 0.25)
  Top 0.152: IC3.2 16.02,19.7 v16.26,19.94 | v25.02,19.68 25.02,18.92 31.62,12.32 31.62,1.78 32.64,0.76 44.2,0.76 44.83,1.4 44.83,3.53 IC1.8 46.13,2.29 TP2.TP
  Bottom 0.152: v16.26,19.94 18.92,19.94 19.3,19.56 22.61,19.56 22.86,19.81 24.89,19.81 v25.02,19.68
RST_3V  (via drill 0.25)
  Top 0.152: IC3.14 8.01,24.37 7.37,25.02 7.37,27.81 8,28.45 20.07,28.45 22.99,25.53 23.62,25.53 24,25.15 24,23.24 24.38,22.86 24.38,17.78 24,17.4 22.35,17.4 22.1,17.14 22.1,14.35 | JP3.9 22.61,5.02 R3.1 22.41,5.15 v21.46,6.1 | 21.46,8.51 v21.46,8.38 22.1,9.02 22.1,14.35 | v22.86,14.35 22.1,14.35
  Bottom 0.152: v21.46,6.1 v21.46,8.38 | U1.14P 14.27,15.32 15.24,14.35 v22.86,14.35
SCK_3V  (via drill 0.25)
  Top 0.152: IC3.8 12.16,22.7 13.84,24.38 19.94,24.38 21.21,23.11 21.21,10.92 18.67,8.38 12.83,8.38 | 12.83,8.38 11.56,9.65 v11.56,9.78 | JP3.5 12.45,8 12.83,8.38
  Bottom 0.152: v11.56,9.78 13.1,11.32 U1.12P
SWCLK
  Top 0.152: IC3.31 10.01,17.67 10.29,17.4 16.89,17.4 17.02,17.53 17.02,18.67 17.53,19.18 J2.4
SWDIO
  Top 0.152: IC3.32 10.51,17.93 10.67,17.78 16.51,17.78 16.64,17.91 16.64,18.92 17.02,19.3 17.02,22.73 17.4,23.11 18.41,23.11 18.8,22.73 J2.2 18.8,21.59
TEST0
  Top 0.152: TP3.TP 4.83,25.78 5.71,24.89 6.73,24.89 7.49,24.13 7.49,23.48 IC3.15
TEST1
  Top 0.152: TP4.TP 3.17,27.69 4.19,26.67 4.19,25.91 5.84,24.26 6.86,24.26 6.98,24.13 6.98,23.48 IC3.16
TEST2
  Top 0.152: IC3.17 6.26,23.33 3.56,26.04 2.67,26.04 TP5.TP
TEST3
  Top 0.152: IC3.18 5.73,22.2 5.46,22.48 5.46,23.62 3.56,25.53 1.4,25.53 TP6.TP
VBAT
  Top 0.813: BAT.2 7.38,11.96 8.38,12.95 D3.A
VDDCORE1
  Top 0.152: C6.1 9.01,16.67 IC3.29
VIN
  Top 0.305: D3.C 12.56,11.22 C3.1
  Top 0.406: U2.3 13.01,13.4 D3.C D2.C 12.88,15.3 U2.1
VOSC
  Top 0.152: IC1.14 46.23,11.18 | 46.23,11.18 47.95,11.18 C9.1 | 46.48,14.1 46.48,11.43 46.23,11.18
VUSB
  Top 0.305: J1.1 3.94,20.95 3.3,20.95 2.79,20.45 2.79,15.11 2.92,14.99 D2.A

### Text on the board
tPlace: T2 | T1 | T0 | T3 | ANT | PROX ANT | 5V | RFM69HCW Radio | VIN | SCK | MOSI | RST | PROX | GND | G0 | MISO | CS
bPlace: Under Construction | v0 1/30/18 MH